# EAGLE schematic Pop-Up Keller Pressure Sensor Interface Board - Rev 4.0 (EAGLE 7.2.0)
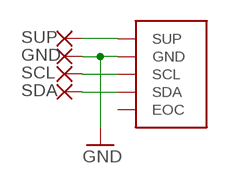
[diagram p0: schematic, sheet 1]

## Parts
GND  SMD075X015  [SMD-0,75X0,15]
P1  4LD  KELLER-4-LD  [KELLER-4-LD]
SCL  SMD075X015  [SMD-0,75X0,15]
SDA  SMD075X015  [SMD-0,75X0,15]
SUP  SMD075X015  [SMD-0,75X0,15]

## Nets
GND: GND.P$1(P) P1.GND
N$1: P1.SUP SUP.P$1(P)
N$2: P1.SCL SCL.P$1(P)
N$3: P1.SDA SDA.P$1(P)
Unconnected: P1.EOC

## Library data of the parts
GND SCL SDA SUP = wirepad:SMD075X015
P1 = User-Submitted:KELLER-4-LD